# Altium schematic sheet Sheet1.SchDoc
size A4; SheetNumber: 2; SheetTotal: 2
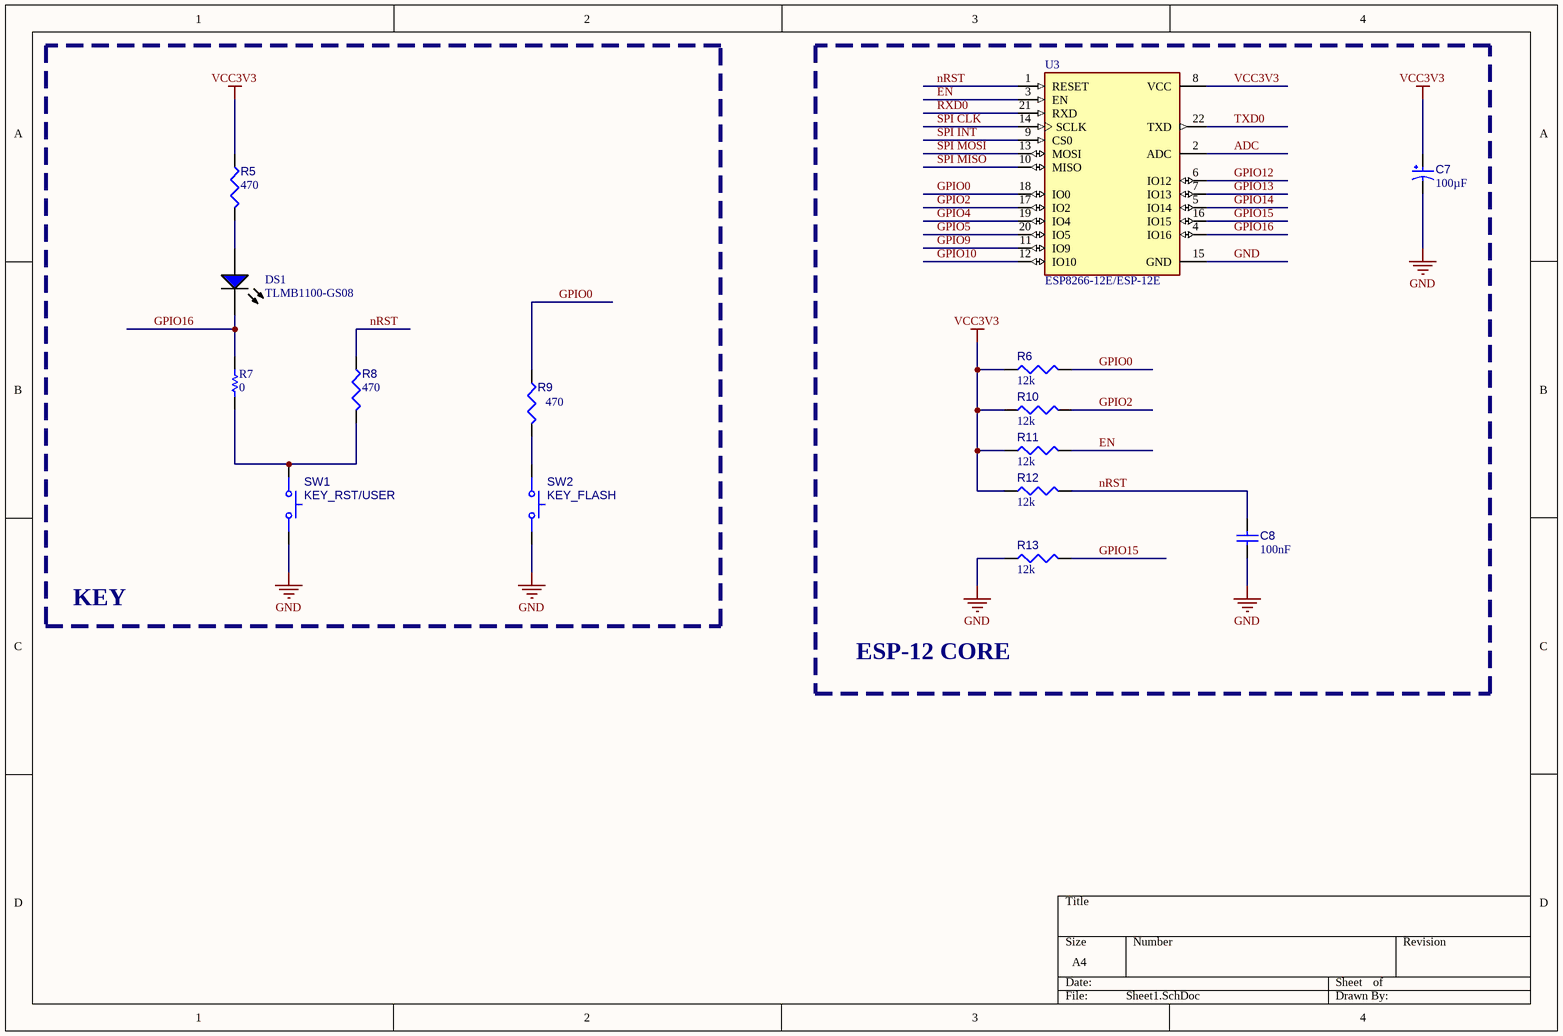
[diagram p0: Sheet1.SchDoc]

## Parts
C7  value 100µF  [AVX-TAJ-C-2_M]  (hidden comment: TAJC107K016RNJ)
C8  value 100nF  [CAPC2013X95X50LL10T25]  (hidden comment: Capacitor 100 nF +/-10% 50 V 0805)
DS1  TLMB1100-GS08  [VISH-TLMX1100-2_V]
R5  value 470  [RESC0805(2012)_L]  (hidden comment: Resistor 470R +/-5% 0805 125 mW)
R6  value 12k  [RESC0402(1005)_L]  (hidden comment: Resistor 12K  +/-1 % 0402 63 mW)
R7  value 0  [RESC1608X55X25ML10T15]  (hidden comment: Resistor 0R +/- 5% 0603 100 mW)
R8  value 470  [RESC0805(2012)_L]  (hidden comment: Resistor 470R +/-5% 0805 125 mW)
R9  value 470  [RESC0805(2012)_L]  (hidden comment: Resistor 470R +/-5% 0805 125 mW)
R10  value 12k  [RESC0402(1005)_L]  (hidden comment: Resistor 12K  +/-1 % 0402 63 mW)
R11  value 12k  [RESC0402(1005)_L]  (hidden comment: Resistor 12K  +/-1 % 0402 63 mW)
R12  value 12k  [RESC0402(1005)_L]  (hidden comment: Resistor 12K  +/-1 % 0402 63 mW)
R13  value 12k  [RESC0402(1005)_L]  (hidden comment: Resistor 12K  +/-1 % 0402 63 mW)
SW1  KEY_RST/USER  [OMRON-B3U-1000P-2-B_V]
SW2  KEY_FLASH  [OMRON-B3U-1000P-2-B_V]
U3  ESP8266-12E/ESP-12E  [XCVR_ESP8266-12E/ESP-12E]

## Blocks framed on the sheet
KEY: DS1 R5 R7-R9 SW1 SW2
ESP-12 CORE: C7 C8 R6 R10-R13 U3

## Nets
GND: C7.2 C8.2 R13.1 SW1.2 SW2.2 U3.15(GND)
VCC3V3: C7.1 R5.1 R6.1 R10.1 R11.1 R12.1 U3.8(VCC)
ADC: U3.2(ADC)
EN: R11.2 U3.3(EN)
GPIO0: R6.2 R9.1 U3.18(IO0)
GPIO2: R10.2 U3.17(IO2)
GPIO4: U3.19(IO4)
GPIO5: U3.20(IO5)
GPIO9: U3.11(IO9)
GPIO10: U3.12(IO10)
GPIO12: U3.6(IO12)
GPIO13: U3.7(IO13)
GPIO14: U3.5(IO14)
GPIO15: R13.2 U3.16(IO15)
GPIO16: DS1.2(K) R7.1 U3.4(IO16)
nRST: C8.1 R8.1 R12.2 U3.1(RESET)
RXD0: U3.21(RXD)
SPI CLK: U3.14(SCLK)
SPI INT: U3.9(CS0)
SPI MISO: U3.10(MISO)
SPI MOSI: U3.13(MOSI)
TXD0: U3.22(TXD)
NetDS1_1: DS1.1(A) R5.2
NetR7_2: R7.2 R8.2 SW1.1
NetR9_2: R9.2 SW2.1

## Library data of the parts
C7 = CMP-001-00046-7: Standard Tantalum, 100 uF, +/- 10%, 16 V, -55 to 125 degC, 2312 (6032 Metric), RoHS, Tape and Reel; Manufacturer: AVX; ESR: 1Ohm; Voltage Rating: 16V; Max Operating Temperature: 125°C; Package Description: 2-Pin Surface Mount Device, Body 6 x 3.25 mm; Datasheet Version: Feb-16; Packaging: TapeandReel; RoHS Compliant: True; Datasheet URL: http://datasheets.avx.com/TAJ.pdf; Case/Package: 2412; Package Quantity: 500; Package Reference: TAJ-C-2; Min Operating Temperature: -55°C; Capacitor Type: Tantalum; Resistance: 1Ohm; Tolerance: 10%; Manufacturer URL: http://www.avx.com/; Mounting Technology: SM
C8 = CMP-001-00018-6: Chip Capacitor, 100 nF, +/- 10%, 50 V, 0805 (2012 Metric); Capacitor Type: Ceramic; Voltage Rating: 50V; Pins: 2; Max Operating Temperature: 125°C; Min Operating Temperature: -55°C; Mounting Technology: SM; Case/Package: 0805; RoHS Compliant: True; Tolerance: 10%
DS1 = CMP-007-00028-2: Blue LED, 10 mA, 3.9 V, -40 to 100 degC, 2-Pin SMD (0603), RoHS, Tape and Reel; Manufacturer: Vishay Semiconductor; Forward Voltage: 3.9V; Viewing Angle: 160degrees; Power: 68mW; Forward Current: 10mA; Lens Style: Diffused; Luminous Intensity: 5mcd; Case/Package: 0603; Datasheet URL: http://download.siliconexpert.com/pdfs/2016/8/7/12/43/26/667/vsh_/manual/379263299541529tlmb1100.pdf; Illumination Colour: Blue; Datasheet Version: Rev. 2.7, 03/2016; Manufacturer URL: http://www.vishay.com/; Package Reference: 0603; Min Operating Temperature: -40°C; Packaging: TapeandReel; RoHS Compliant: True; Nominal Vf: 3.9V; Mounting Technology: SM; Pins: 2; Package Description: 2-Pin Surface Mount Device, Body 1.6 x 0.8 mm; Colour: Blue; Package Quantity: 3000; Max Operating Temperature: 100°C
R5 R8 R9 = CMP-009-00122-3: Chip Resistor, 470 Ohms, +/-5%, 125 mW, -55 to 155 degC, 0805; Tolerance: 5%; Power: 125mW; Max Operating Temperature: 155°C; Case/Package: 0805; Pins: 2; Min Operating Temperature: -55°C
R6 R10-R13 = CMP-009-00173-3: Chip Resistor, 12 kOhms, +/-1 %, 63 mW, -55 to 155 degC, 0402; Power: 63mW; Tolerance: 1%; Max Operating Temperature: 155°C; Min Operating Temperature: -55°C; Case/Package: 0402; Pins: 2
R7 = CMP-009-00006-5: Chip Resistor, 0 Ohm, 0.1 W, -55 to 155 degC, 0603 (1608 Metric); Power: 100mW; Voltage Rating: 50V; Max Operating Temperature: 155°C; RoHS Compliant: True; Mounting Technology: SM; Case/Package: 0603; Min Operating Temperature: -55°C; Tolerance: 5%; Pins: 2
SW1 SW2 = CMP-011-00011-3: Ultra-small Surface-mounting Tactile Switches with High Contact Reliability, SPST-NO, -25 to 70 degC, 2-Pin SMD, RoHS, Tape and Reel; Voltage Rating: 12V; Current Rating: 50mA; Pins: 2; RoHS Compliant: Details
U3 = CMP-009-000000-1: This WiFi module has a 32-bit MCU micro and clock speeds supporting 80 MHz or 160 MHz. Supports the RTOS and integrated Wi-Fi MAC/BB/RF/PA/LNA, and has an on-board antenna.; MF: AI-Thinker; SnapEDA_Link: https://www.snapeda.com/parts/ESP8266-12E/ESP-12E/AI-Thinker/view-part/?ref=snap; MP: ESP8266-12E/ESP-12E; Value: *; Availability: Not in stock; Check_prices: https://www.snapeda.com/parts/ESP8266-12E/ESP-12E/AI-Thinker/view-part/?ref=eda; Component Type: Standard; Package: None; Source: ESP8266-12E_ESP-12E.SchLib; Design Item ID: ESP8266-12E/ESP-12E; Price: None; Pin Count: 22